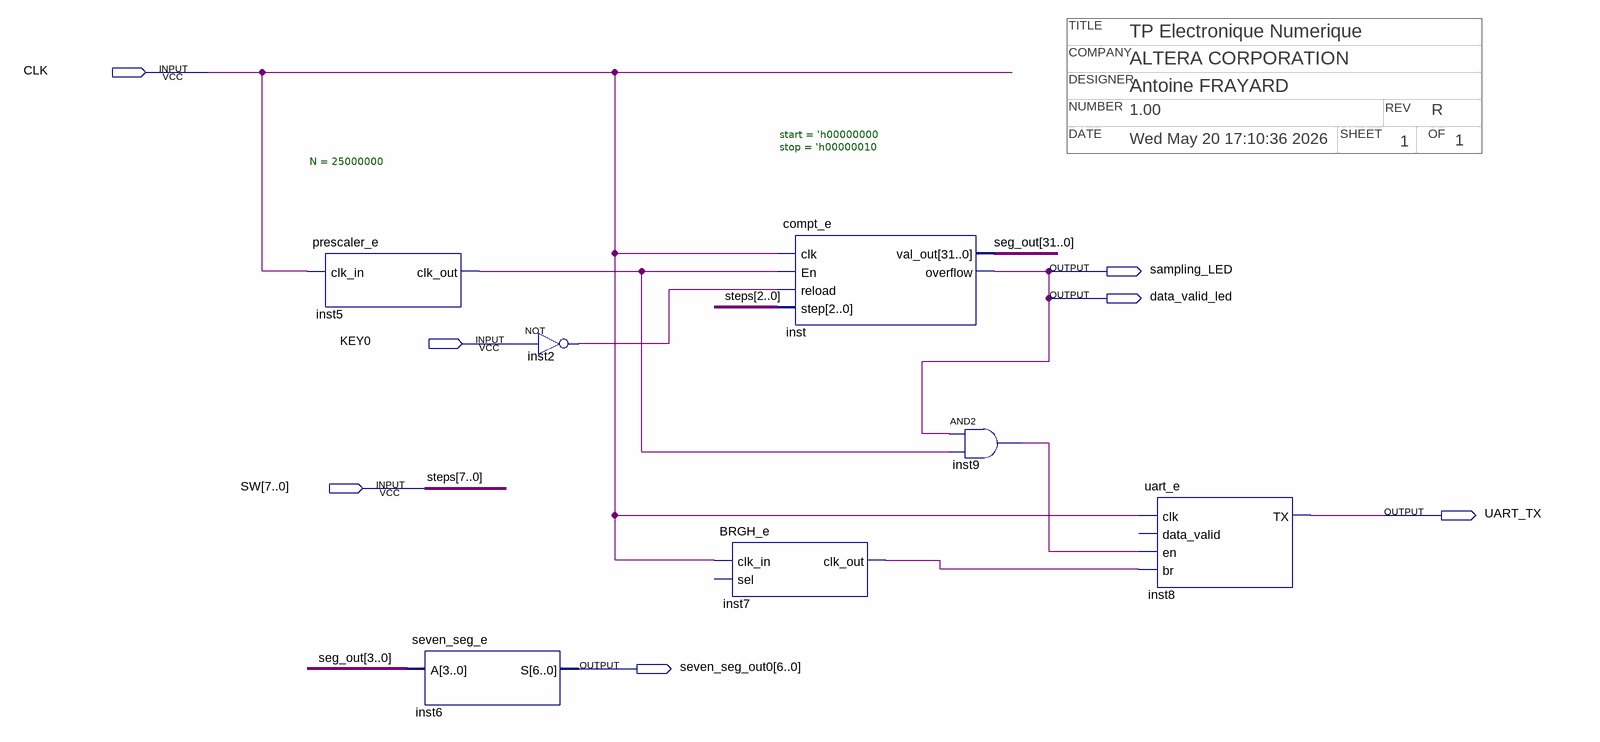
[diagram p0: schematic sheet]
// Quartus schematic EXAM_TP_ELEC_NUM.bdf as structural Verilog: 7 symbols, 7 pins
// Title block: COMPANY: ALTERA CORPORATION; DATE: Wed May 20 17:10:36 2026; DESIGNER: Antoine FRAYARD; NUMBER: 1.00; OF: 1; REV: R; SHEET: 1; TITLE: TP Electronique Numerique
module EXAM_TP_ELEC_NUM (
  input  CLK,
  input  KEY0,
  input  [7:0] SW,
  output sampling_LED,
  output data_valid_led,
  output UART_TX,
  output [6:0] seven_seg_out0
);

  wire inst2_out, inst5_clk_out, inst7_clk_out, inst9_out;
  wire [31:0] seg_out;

  prescaler_e #(.N(25000000)) inst5 (.clk_in(CLK), .clk_out(inst5_clk_out));
  seven_seg_e inst6 (.A(seg_out[3:0]), .S(seven_seg_out0));
  not inst2 (inst2_out, KEY0);
  BRGH_e inst7 (.clk_in(CLK), .clk_out(inst7_clk_out));  // open: sel
  compt_e #(.start('h00000000), .stop('h00000010)) inst (
    .clk(CLK), .En(inst5_clk_out), .reload(inst2_out), .step(SW[2:0]), .val_out(seg_out),
    .overflow(data_valid_led));
  and inst9 (inst9_out, data_valid_led, inst5_clk_out);
  uart_e inst8 (.clk(CLK), .en(inst9_out), .br(inst7_clk_out), .TX(UART_TX));  // open: data_valid

  assign sampling_LED = data_valid_led;

  // Other names for the same wires on the sheet: steps[7:0] = SW
endmodule
